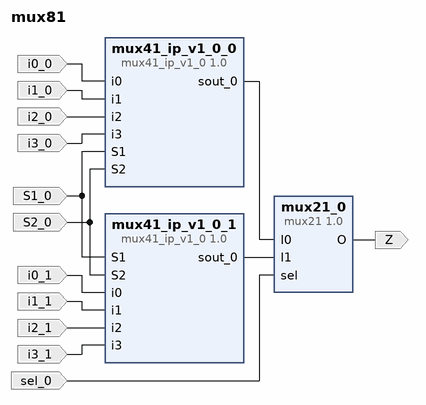
[diagram p0: block diagram of the top level]
# Vivado block design mux81, xc7z020clg484-1, Vivado 2023.2
create_bd_design mux81

create_bd_port -dir O Z
create_bd_port -dir I S1_0
create_bd_port -dir I i3_0
create_bd_port -dir I i2_0
create_bd_port -dir I i1_0
create_bd_port -dir I i0_0
create_bd_port -dir I S2_0
create_bd_port -dir I i3_1
create_bd_port -dir I i2_1
create_bd_port -dir I i1_1
create_bd_port -dir I i0_1
create_bd_port -dir I sel_0

create_bd_cell -type ip -vlnv xilinx.com:user:mux41_ip_v1_0:1.0 mux41_ip_v1_0_0
create_bd_cell -type ip -vlnv xilinx.com:user:mux41_ip_v1_0:1.0 mux41_ip_v1_0_1
create_bd_cell -type ip -vlnv xilinx.com:user:mux21:1.0 mux21_0

# ---- connections ----

connect_bd_net -net S1_0_1 [get_bd_ports S1_0] [get_bd_pins mux41_ip_v1_0_0/S1] [get_bd_pins mux41_ip_v1_0_1/S1]
connect_bd_net -net S2_0_1 [get_bd_ports S2_0] [get_bd_pins mux41_ip_v1_0_0/S2] [get_bd_pins mux41_ip_v1_0_1/S2]
connect_bd_net -net i0_0_1 [get_bd_ports i0_0] [get_bd_pins mux41_ip_v1_0_0/i0]
connect_bd_net -net i0_1_1 [get_bd_ports i0_1] [get_bd_pins mux41_ip_v1_0_1/i0]
connect_bd_net -net i1_0_1 [get_bd_ports i1_0] [get_bd_pins mux41_ip_v1_0_0/i1]
connect_bd_net -net i1_1_1 [get_bd_ports i1_1] [get_bd_pins mux41_ip_v1_0_1/i1]
connect_bd_net -net i2_0_1 [get_bd_ports i2_0] [get_bd_pins mux41_ip_v1_0_0/i2]
connect_bd_net -net i2_1_1 [get_bd_ports i2_1] [get_bd_pins mux41_ip_v1_0_1/i2]
connect_bd_net -net i3_0_1 [get_bd_ports i3_0] [get_bd_pins mux41_ip_v1_0_0/i3]
connect_bd_net -net i3_1_1 [get_bd_ports i3_1] [get_bd_pins mux41_ip_v1_0_1/i3]
connect_bd_net [get_bd_pins mux21_0/O] [get_bd_ports Z]
connect_bd_net [get_bd_pins mux41_ip_v1_0_0/sout_0] [get_bd_pins mux21_0/I0]
connect_bd_net [get_bd_pins mux41_ip_v1_0_1/sout_0] [get_bd_pins mux21_0/I1]
connect_bd_net -net sel_0_1 [get_bd_ports sel_0] [get_bd_pins mux21_0/sel]

validate_bd_design
save_bd_design
